# EAGLE board Versie2 (EAGLE 6.5.0), part 1 of 2
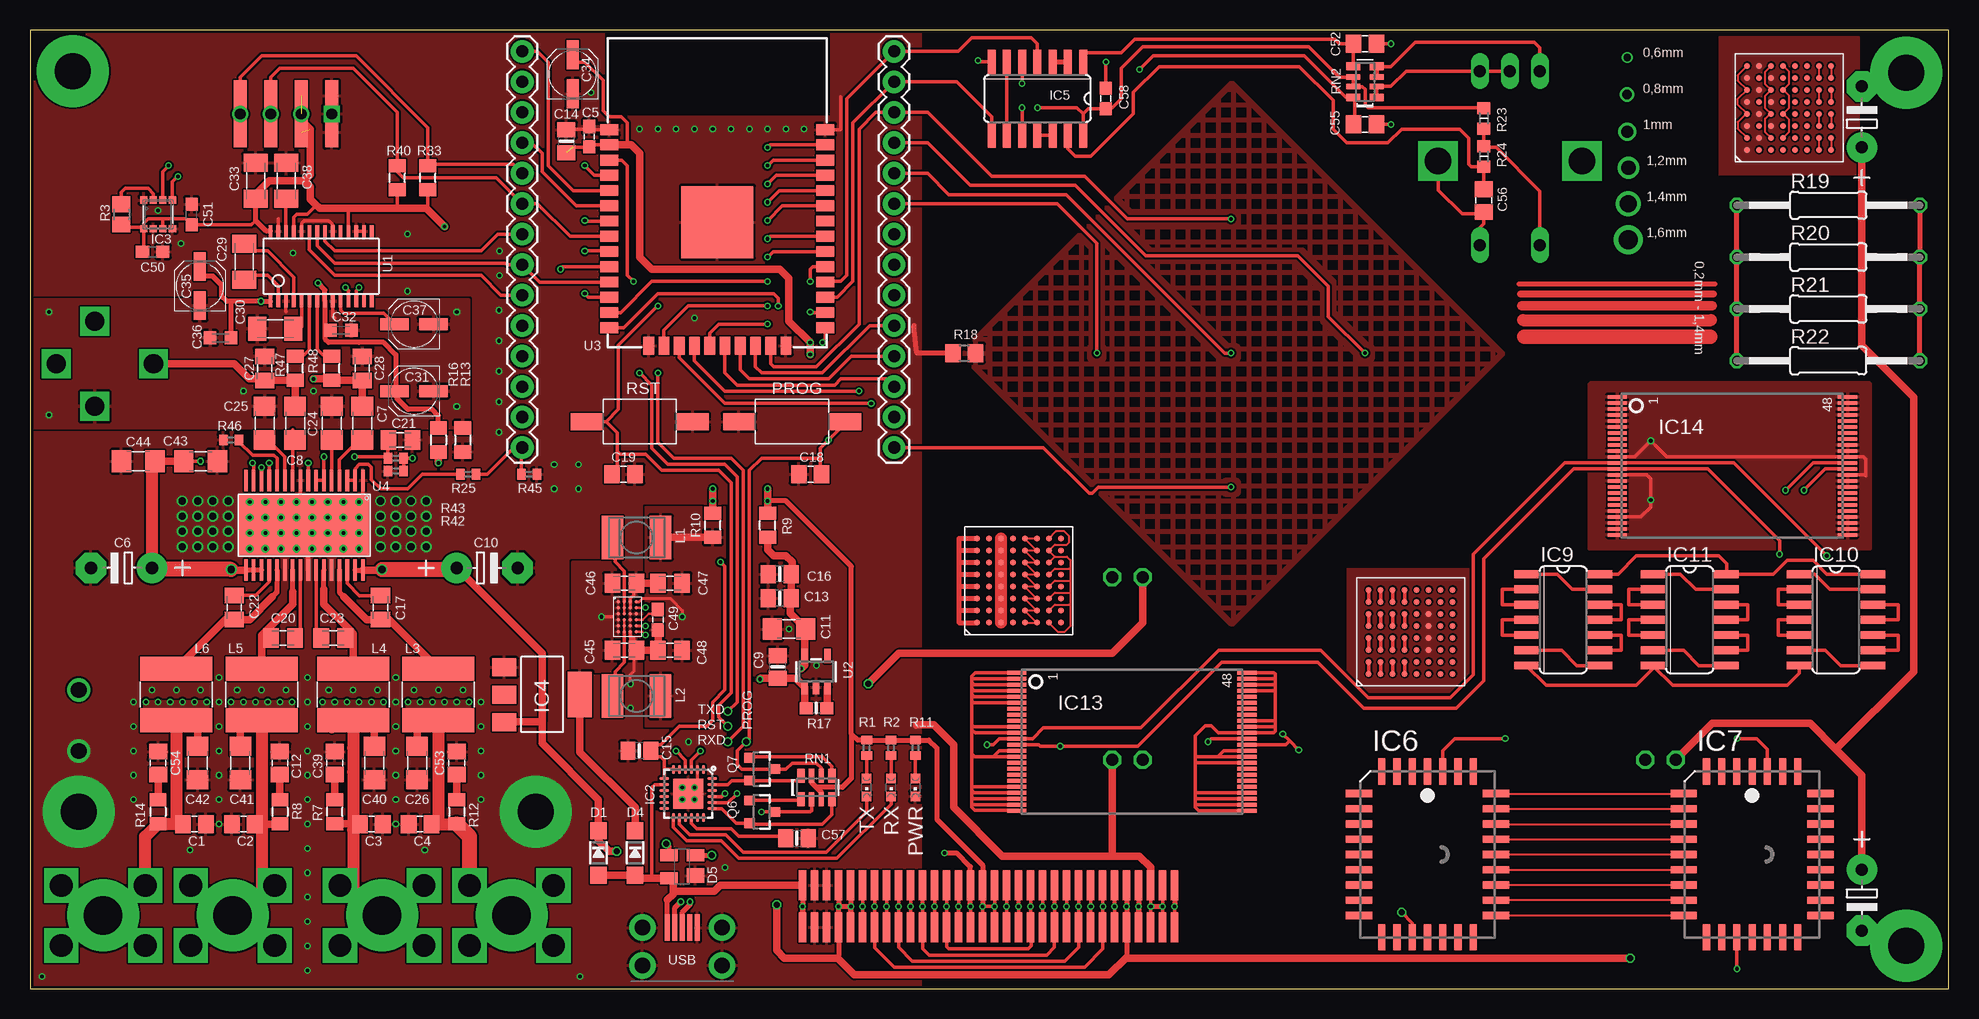
[diagram p7: board, top side]
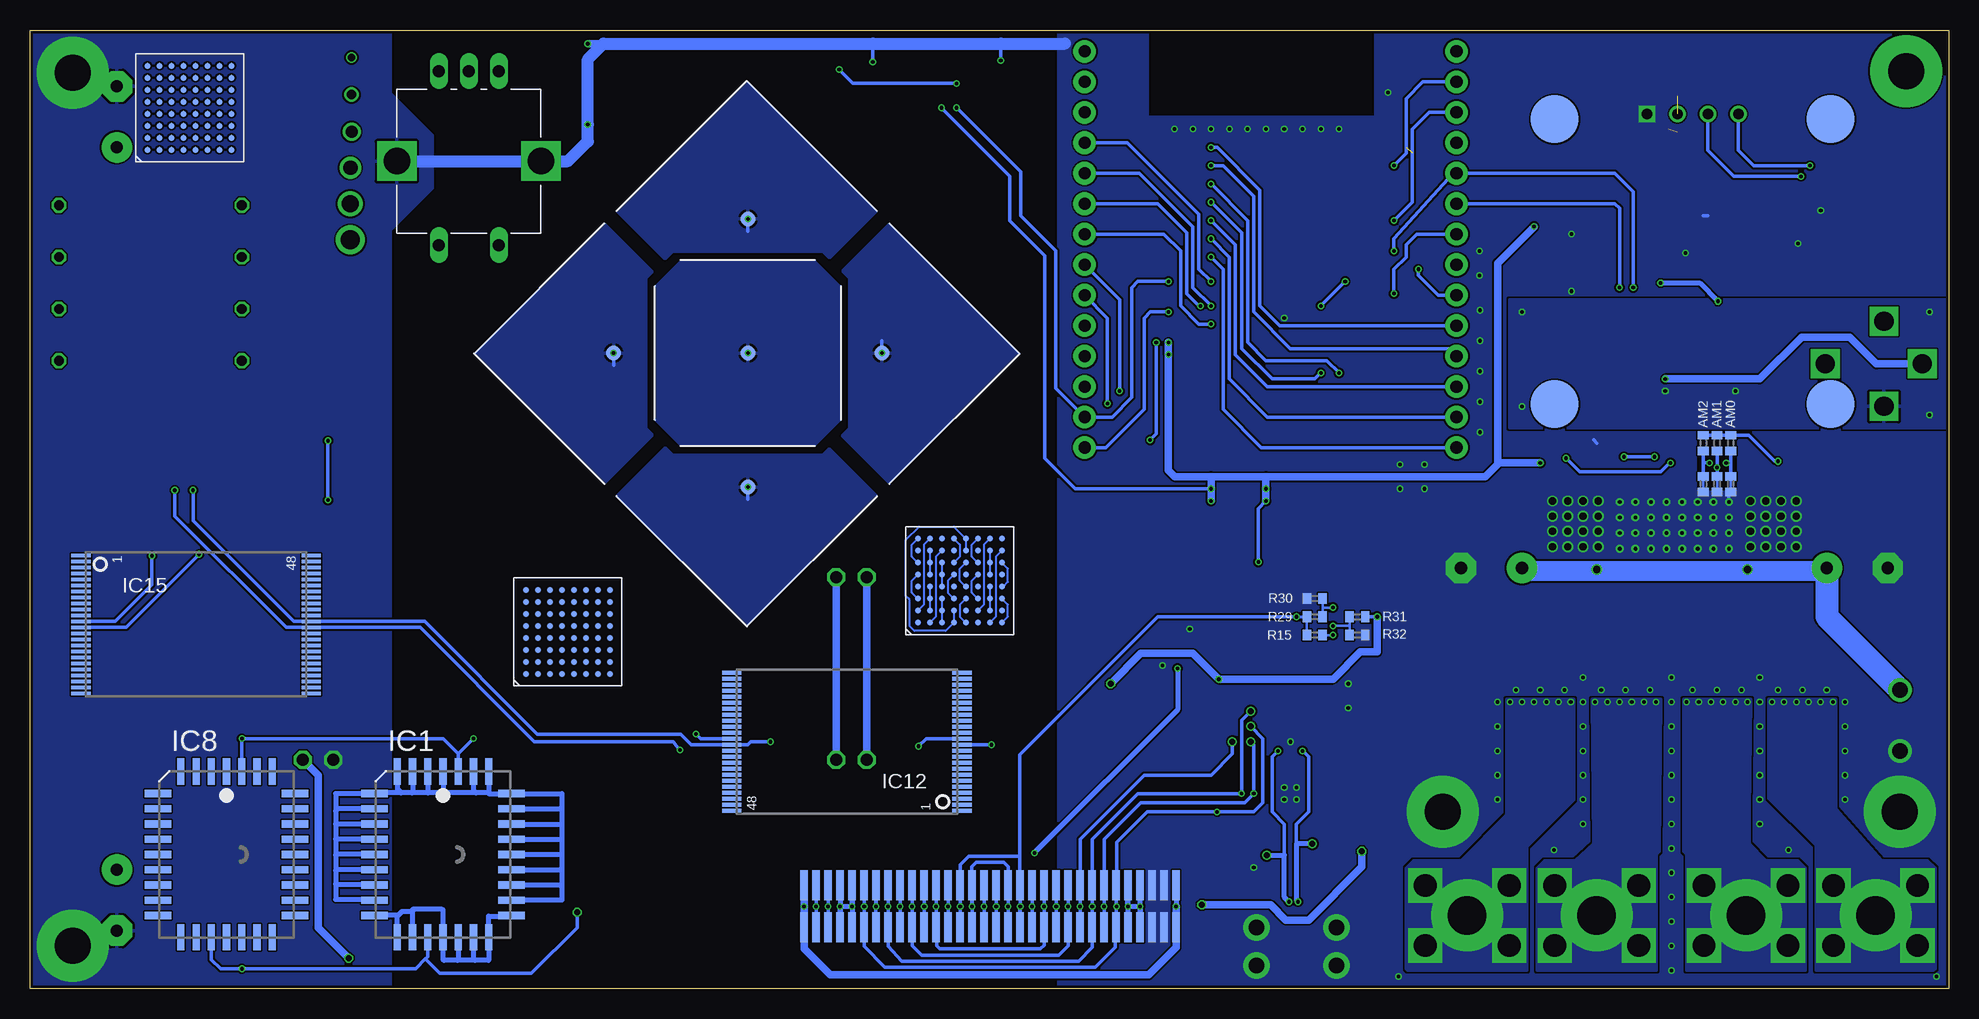
[diagram p8: board, bottom side, seen from below]

Size 159.89 x 79.88 mm. Coordinates in mm from the lower left corner, seen from the top.
Outline: 159.89,0 159.89,79.88 0,79.88 0,0 159.89,0
Copper layers (1*16): Top 0.018mm / dielectric 1.55mm / Bottom 0.018mm
Design rules "eC_2Layer_PClass6_BaseCopperO18_eCDefault *": minimum track width 0.15mm, minimum drill 0.3mm, track to track 0.15mm, track to pad 0.15mm, pad to pad 0.15mm, via to via 0.15mm, smd to smd 0mil, copper to edge 0.25mm, drill to drill 0.35mm, minimum pad ring 0.175mm, minimum via ring 0.125mm, stop-mask expansion 0mil, vias tented up to drill 0.45mm, thermal gap 0.2mm
Net classes: 0 default: width 0.152 mm, drill 0.25 mm, clearance 0.152 mm; 1 gnd: width 0.254 mm, drill 0.3 mm, clearance 0.152 mm; 2 vcc: width 0.254 mm, drill 0.3 mm, clearance 0.152 mm

## Footprints (pad centres in the part's own frame; a part is rotated, then mirrored left to right if it is on the bottom)
R0402 = smd 0.7 x 0.9: 1 -0.65,0; 2 0.65,0
C0805 = smd 1.3 x 1.5: 1 -0.95,0; 2 0.95,0
C0603 = smd 1.1 x 1: 1 -0.85,0; 2 0.85,0
E5-13 = drill 1.016 pad 2.54: + -2.54,0 | drill 1.016 pad 2.54 octagon: - 2.54,0
C1206 = smd 1.6 x 1.8: 1 -1.4,0; 2 1.4,0
0805-NO = smd 1.24 x 1.5: 1 -0.95,0; 2 0.95,0
C0805K = smd 1.3 x 1.6: 1 -1,0; 2 1,0
C1206K = smd 1.5 x 2: 1 -1.5,0; 2 1.5,0
UD-4X5,8_NICHICON = smd 2.4 x 1: + 1.625,0; - -1.625,0
C0603K = smd 1.05 x 1.08: 1 -0.875,0; 2 0.875,0
0603 = smd 1.1 x 1: 1 -0.85,0; 2 0.85,0
SOD-123 = smd 1.4 x 1.4: A 1.85,0; C -1.85,0
SOT143 = smd 1.2 x 1.44: 1 -0.75,-1.1 | smd 1 x 1.44: 2 0.95,-1.1; 3 0.95,1.1; 4 -0.95,1.1
PLCC32R = smd 0.6 x 2.2: 1 0,6.9; 2 -1.27,6.9; 3 -2.54,6.9; 4 -3.81,6.9; 14 -3.81,-6.9; 15 -2.54,-6.9; 16 -1.27,-6.9; 17 0,-6.9; 18 1.27,-6.9; 19 2.54,-6.9; 20 3.81,-6.9; 30 3.81,6.9; 31 2.54,6.9; 32 1.27,6.9 | smd 2.2 x 0.6: 5 -5.7,5.08; 6 -5.7,3.81; 7 -5.7,2.54; 8 -5.7,1.27; 9 -5.7,0; 10 -5.7,-1.27; 11 -5.7,-2.54; 12 -5.7,-3.81; 13 -5.7,-5.08; 21 5.7,-5.08; 22 5.7,-3.81; 23 5.7,-2.54; 24 5.7,-1.27; 25 5.7,0; 26 5.7,1.27; 27 5.7,2.54; 28 5.7,3.81; 29 5.7,5.08
QFN24_4MM_SMSC = smd 0.8 x 0.28: 1 -2,1.25; 2 -2,0.75; 3 -2,0.25; 4 -2,-0.25; 5 -2,-0.75; 6 -2,-1.25; 13 2,-1.25; 14 2,-0.75; 15 2,-0.25; 16 2,0.25; 17 2,0.75; 18 2,1.25 | smd 0.28 x 0.8: 7 -1.25,-2; 8 -0.75,-2; 9 -0.25,-2; 10 0.25,-2; 11 0.75,-2; 12 1.25,-2; 19 1.25,2; 20 0.75,2; 21 0.25,2; 22 -0.25,2; 23 -0.75,2; 24 -1.25,2 | smd 2.5 x 2.5: THERM 0,0
BME280 = smd 0.6 x 0.6: 1 1.2,-1.2; 2 0.4,-1.2; 3 -0.4,-1.2; 4 -1.2,-1.2; 5 -1.2,1.2; 6 -0.4,1.2; 7 0.4,1.2; 8 1.2,1.2
SOT223 = smd 1.499 x 2.007: 1 -2.261,-3.15; 2 0.025,-3.15; 3 2.311,-3.15 | smd 3.81 x 2.007: 4 0,3.15
SO14 = smd 0.66 x 2.032: 1 -3.81,-3.073; 2 -2.54,-3.073; 3 -1.27,-3.073; 4 0,-3.073; 5 1.27,-3.073; 6 2.54,-3.073; 7 3.81,-3.073; 8 3.81,3.073; 9 2.54,3.073; 10 1.27,3.073; 11 0,3.073; 12 -1.27,3.073; 13 -2.54,3.073; 14 -3.81,3.073
TSOP48 = smd 1.6 x 0.3: 1 -9.6,5.75; 2 -9.6,5.25; 3 -9.6,4.75; 4 -9.6,4.25; 5 -9.6,3.75; 6 -9.6,3.25; 7 -9.6,2.75; 8 -9.6,2.25; 9 -9.6,1.75; 10 -9.6,1.25; 11 -9.6,0.75; 12 -9.6,0.25; 13 -9.6,-0.25; 14 -9.6,-0.75; 15 -9.6,-1.25; 16 -9.6,-1.75; 17 -9.6,-2.25; 18 -9.6,-2.75; 19 -9.6,-3.25; 20 -9.6,-3.75; 21 -9.6,-4.25; 22 -9.6,-4.75; 23 -9.6,-5.25; 24 -9.6,-5.75; 25 9.6,-5.75; 26 9.6,-5.25; 27 9.6,-4.75; 28 9.6,-4.25; 29 9.6,-3.75; 30 9.6,-3.25; 31 9.6,-2.75; 32 9.6,-2.25; 33 9.6,-1.75; 34 9.6,-1.25; 35 9.6,-0.75; 36 9.6,-0.25; 37 9.6,0.25; 38 9.6,0.75; 39 9.6,1.25; 40 9.6,1.75; 41 9.6,2.25; 42 9.6,2.75; 43 9.6,3.25; 44 9.6,3.75; 45 9.6,4.25; 46 9.6,4.75; 47 9.6,5.25; 48 9.6,5.75
1X14 = drill 1.016 pad 1.88: 1 0,0; 2 2.54,0; 3 5.08,0; 4 7.62,0; 5 10.16,0; 6 12.7,0; 7 15.24,0; 8 17.78,0; 9 20.32,0; 10 22.86,0; 11 25.4,0; 12 27.94,0; 13 30.48,0; 14 33.02,0
L4532P = smd 1.8 x 3.6: 1 -2,0; 2 2,0
SRN6045 = smd 2 x 6: 1 -2.15,0; 2 2.15,0
CHIPLED_0603 = smd 0.8 x 0.8: A 0,-0.75; C 0,0.75
SOT23-3 = smd 0.8 x 0.9: 1 -0.95,-1; 2 0.95,-1; 3 0,1.1
R0805 = smd 1.3 x 1.5: 1 -0.85,0; 2 0.85,0
R0805' = smd 1.1 x 1.4: 1 -1,0; 2 1,0
0603-NO = smd 1.075 x 1: 1 -0.85,0; 2 0.85,0
R0805'' = smd 1.3 x 1.5: 1 -0.95,0; 2 0.95,0
0207/15 = drill 0.813 octagon: 1 -7.62,0; 2 7.62,0
R0603 = smd 1 x 1.1: 1 -0.85,0; 2 0.85,0
RN8P-4R-CRA06S = smd 0.63 x 1.15: 1 -1.295,-0.975; 4 1.295,-0.975; 5 1.295,0.975; 8 -1.295,0.975 | smd 0.44 x 1.15: 2 -0.4,-0.975; 3 0.4,-0.975; 6 0.4,0.975; 7 -0.4,0.975
SW2-4.0-6.0X3.0X2.5MM = smd 2.65 x 1.4: 1 -4.425,0; 2 4.425,0
B1,27 = smd 1.27 x 1.27: TP 0,0
TSSOP-28 = smd 0.305 x 0.991: 1 -4.225,-2.918; 2 -3.575,-2.918; 3 -2.925,-2.918; 4 -2.275,-2.918; 5 -1.625,-2.918; 6 -0.975,-2.918; 7 -0.325,-2.918; 8 0.325,-2.918; 9 0.975,-2.918; 10 1.625,-2.918; 11 2.275,-2.918; 12 2.925,-2.918; 13 3.575,-2.918; 14 4.225,-2.918; 15 4.225,2.918; 16 3.575,2.918; 17 2.925,2.918; 18 2.275,2.918; 19 1.625,2.918; 20 0.975,2.918; 21 0.325,2.918; 22 -0.325,2.918; 23 -0.975,2.918; 24 -1.625,2.918; 25 -2.275,2.918; 26 -2.925,2.918; 27 -3.575,2.918; 28 -4.225,2.918
SOT23-5 = smd 0.55 x 1.2: 1 -0.95,-1.3; 2 0,-1.3; 3 0.95,-1.3; 4 0.95,1.3; 5 -0.95,1.3
ESP-WROOM-32 = smd 0.9 x 1.5: 1 7.7,9; 2 6.43,9; 3 5.16,9; 4 3.89,9; 5 2.62,9; 6 1.35,9; 7 0.08,9; 8 -1.19,9; 9 -2.46,9; 10 -3.73,9; 11 -5,9; 12 -6.27,9; 13 -7.54,9; 14 -8.81,9; 25 -8.81,-9; 26 -7.54,-9; 27 -6.27,-9; 28 -5,-9; 29 -3.73,-9; 30 -2.46,-9; 31 -1.19,-9; 32 0.08,-9; 33 1.35,-9; 34 2.62,-9; 35 3.89,-9; 36 5.16,-9; 37 6.43,-9; 38 7.7,-9 | smd 1.5 x 0.9: 15 -10.3,5.715; 16 -10.3,4.445; 17 -10.3,3.175; 18 -10.3,1.905; 19 -10.3,0.635; 20 -10.3,-0.635; 21 -10.3,-1.905; 22 -10.3,-3.175; 23 -10.3,-4.445; 24 -10.3,-5.715 | smd 6 x 6: GND 0,0
TSSOP32-GROUNDPAD = smd 1.8 x 0.3: AM0 -3.737,-4.225; AM1 -3.737,-3.575; AM2 -3.737,-2.925; AVCC 3.737,-4.875; BSNL 3.737,-2.925; BSNR 3.737,0.975; BSPL 3.737,-0.325; BSPR 3.737,3.575; FAULTZ -3.737,3.575; GAIN/SLV -3.737,0.325; GND1 -3.737,-0.325; GND2 3.737,-1.625; GND3 3.737,0.325; GND4 3.737,2.275; GVDD -3.737,0.975; INNL -3.737,-1.625; INNR -3.737,2.275; INPL -3.737,-0.975; INPR -3.737,2.925; MODSEL -3.737,4.875; MUTE -3.737,-2.275; OUTNL 3.737,-2.275; OUTNR 3.737,1.625; OUTPL 3.737,-0.975; OUTPR 3.737,2.925; PLIMIT -3.737,1.625; PVCC1 3.737,-4.225; PVCC2 3.737,-3.575; PVCC3 3.737,4.225; PVCC4 3.737,4.875; SDZ -3.737,4.225; SYNC -3.737,-4.875 | drill 0.3: P$33 0.65,4.55; P$34 -0.65,4.55; P$35 -1.95,4.55; P$36 1.95,4.55; P$37 -1.95,3.25; P$38 -1.95,1.95; P$39 -1.95,0.65; P$40 -1.95,-0.65; P$41 -1.95,-1.95; P$42 -1.95,-3.25; P$43 -1.95,-4.55; P$44 -0.65,3.25; P$45 0.65,3.25; P$46 1.95,3.25; P$47 -0.65,1.95; P$48 0.65,1.95; P$49 1.95,1.95; P$50 1.95,0.65; P$51 0.65,0.65; P$52 -0.65,0.65; P$53 -0.65,-0.65; P$54 0.65,-0.65; P$55 1.95,-0.65; P$56 1.95,-1.95; P$57 1.95,-3.25; P$58 1.95,-4.55; P$59 0.65,-4.55; P$60 0.65,-3.25; P$61 0.65,-1.95; P$62 -0.65,-1.95; P$63 -0.65,-3.25; P$64 -0.65,-4.55 | smd 5 x 11: POWERPAD 0,0.005
0714360864 = smd 0.635 x 2.5: P$1 -15.5,-1.75; P$2 -14.5,-1.75; P$3 -13.5,-1.75; P$4 -12.5,-1.75; P$5 -11.5,-1.75; P$6 -10.5,-1.75; P$7 -9.5,-1.75; P$8 -8.5,-1.75; P$9 -7.5,-1.75; P$10 -6.5,-1.75; P$11 -5.5,-1.75; P$12 -4.5,-1.75; P$13 -3.5,-1.75; P$14 -2.5,-1.75; P$15 -1.5,-1.75; P$16 -0.5,-1.75; P$17 0.5,-1.75; P$18 1.5,-1.75; P$19 2.5,-1.75; P$20 3.5,-1.75; P$21 4.5,-1.75; P$22 5.5,-1.75; P$23 6.5,-1.75; P$24 7.5,-1.75; P$25 8.5,-1.75; P$26 9.5,-1.75; P$27 10.5,-1.75; P$28 11.5,-1.75; P$29 12.5,-1.75; P$30 13.5,-1.75; P$31 14.5,-1.75; P$32 15.5,-1.75; P$33 15.5,1.75; P$34 14.5,1.75; P$35 13.5,1.75; P$36 12.5,1.75; P$37 11.5,1.75; P$38 10.5,1.75; P$39 9.5,1.75; P$40 8.5,1.75; P$41 7.5,1.75; P$42 6.5,1.75; P$43 5.5,1.75; P$44 4.5,1.75; P$45 3.5,1.75; P$46 2.5,1.75; P$47 1.5,1.75; P$48 0.5,1.75; P$49 -0.5,1.75; P$50 -1.5,1.75; P$51 -2.5,1.75; P$52 -3.5,1.75; P$53 -4.5,1.75; P$54 -5.5,1.75; P$55 -6.5,1.75; P$56 -7.5,1.75; P$57 -8.5,1.75; P$58 -9.5,1.75; P$59 -10.5,1.75; P$60 -11.5,1.75; P$61 -12.5,1.75; P$62 -13.5,1.75; P$63 -14.5,1.75; P$64 -15.5,1.75
DISPLAY = drill 0.9 square: P$1 -3.81,12.18 | drill 0.9: P$2 -1.27,12.18; P$3 1.27,12.18; P$4 3.81,12.18 | smd 4 x 4: P$5 -11.5,11.75; P$6 11.5,11.75; P$7 -11.5,-12; P$8 11.5,-12 | smd 1.1 x 2.54 bottom: P$9 -3.81,10.668; P$10 -1.27,13.716; P$11 1.27,10.668; P$12 3.81,13.716; P$13 -3.81,13.716; P$14 -1.27,10.668; P$15 1.27,13.716; P$16 3.81,10.668
BGA64 = smd 0.5 x 0.5: P$1 -3.5,3.5; P$2 -3.5,2.5; P$3 -3.5,1.5; P$4 -3.5,0.5; P$5 -3.5,-0.5; P$6 -3.5,-1.5; P$7 -3.5,-2.5; P$8 -3.5,-3.5; P$9 -2.5,3.5; P$10 -2.5,2.5; P$11 -2.5,1.5; P$12 -2.5,0.5; P$13 -2.5,-0.5; P$14 -2.5,-1.5; P$15 -2.5,-2.5; P$16 -2.5,-3.5; P$17 -1.5,3.5; P$18 -1.5,2.5; P$19 -1.5,1.5; P$20 -1.5,0.5; P$21 -1.5,-0.5; P$22 -1.5,-1.5; P$23 -1.5,-2.5; P$24 -1.5,-3.5; P$25 -0.5,3.5; P$26 -0.5,2.5; P$27 -0.5,1.5; P$28 -0.5,0.5; P$29 -0.5,-0.5; P$30 -0.5,-1.5; P$31 -0.5,-2.5; P$32 -0.5,-3.5; P$33 0.5,3.5; P$34 0.5,2.5; P$35 0.5,1.5; P$36 0.5,0.5; P$37 0.5,-0.5; P$38 0.5,-1.5; P$39 0.5,-2.5; P$40 0.5,-3.5; P$41 1.5,3.5; P$42 1.5,2.5; P$43 1.5,1.5; P$44 1.5,0.5; P$45 1.5,-0.5; P$46 1.5,-1.5; P$47 1.5,-2.5; P$48 1.5,-3.5; P$49 2.5,3.5; P$50 2.5,2.5; P$51 2.5,1.5; P$52 2.5,0.5; P$53 2.5,-0.5; P$54 2.5,-1.5; P$55 2.5,-2.5; P$56 2.5,-3.5; P$57 3.5,3.5; P$58 3.5,2.5; P$59 3.5,1.5; P$60 3.5,0.5; P$61 3.5,-0.5; P$62 3.5,-1.5; P$63 3.5,-2.5; P$64 3.5,-3.5
SCREWCON = drill 1.9 square: P$1 -2.5,3.5; P$2 2.5,3.5; P$3 -2.5,-3.5; P$4 2.5,-3.5
DSBGA24 = smd 0.3 x 0.3: A1 1.249,0.751; A2 1.249,0.251; A3 1.249,-0.249; A4 1.249,-0.749; B1 0.749,0.751; B2 0.749,0.251; B3 0.749,-0.249; B4 0.749,-0.749; C1 0.249,0.751; C2 0.249,0.251; C3 0.249,-0.249; C4 0.249,-0.749; D1 -0.251,0.751; D2 -0.251,0.251; D3 -0.251,-0.249; D4 -0.251,-0.749; E1 -0.751,0.751; E2 -0.751,0.251; E3 -0.751,-0.249; E4 -0.751,-0.749; F1 -1.251,0.751; F2 -1.251,0.251; F3 -1.251,-0.249; F4 -1.251,-0.749
JACKSTRAIGHTUP = drill 1.6 square: P$1 -3.55,0; P$2 0,3.2; P$3 3.55,0; P$4 0,-4.9
ENCODER = drill 1 long: A 2.5,-7.5; B1 0,-7.5; B2 -2.5,-7.5; COM -2.5,7; SW 2.5,7 | drill 2.2 square: P$6 -6,0; P$7 6,0
MICRO-B-SMT = smd 0.4 x 2.2: 1 1.24,0; 2 0.62,0; 3 0,0; 4 -0.62,0; 5 -1.24,0 | drill 1.3 pad 2.2: P$6 -3.325,3.15; P$7 -3.325,0; P$8 3.325,3.15; P$9 3.325,0

## Placement (x,y rotation side)
AM0  0  [R0402]  18.16,42.04 90 bottom
AM1  0  [R0402]  19.3,42.04 90 bottom
AM2  0  [R0402]  20.45,42.04 90 bottom
C1  1n  [C0805]  13.72,13.72 180 top
C2  1n  [C0805]  17.78,13.72 180 top
C3  1n  [C0805]  28.45,13.72 180 top
C4  1n  [C0805]  32.51,13.72 180 top
C5  100n  [C0603]  46.61,70.99 90 top
C6  [E5-13]  7.62,35.05 180 top
C7  1u  [C1206]  27.69,47.12 270 top
C8  1u  [C1206]  22.1,47.12 270 top
C9  10uF  [0805-NO]  62.32,26.8 90 top
C10  [E5-13]  38.1,35.05 0 top
C11  1uF  [C1206]  63.25,29.96 180 top
C12  10n  [C0805]  20.83,18.8 90 top
C13  10uF  [0805-NO]  62.47,32.52 180 top
C14  10uF  [0805-NO]  44.7,70.61 90 top
C15  10uF  [0805-NO]  50.79,19.81 180 top
C16  10uF  [0805-NO]  62.48,34.54 180 top
C17  220n  [C0805K]  29.21,31.75 270 top
C18  1n  [C0805]  65.02,42.86 180 top
C19  1n  [C0805]  49.47,42.86 0 top
C20  220n  [C0805K]  21.08,29.21 180 top
C21  1u  [C0805K]  30.86,45.72 0 top
C22  220n  [C0805K]  17.02,31.75 270 top
C23  220n  [C0805K]  25.27,29.21 0 top
C24  1u  [C1206]  25.15,47.12 270 top
C25  1u  [C1206]  19.56,47.12 270 top
C26  1u  [C1206]  32.26,18.8 90 top
C27  2n2  [C0805K]  19.56,51.69 90 top
C28  2n2  [C0805K]  27.69,51.69 90 top
C29  2u2  [C1206K]  17.84,60.58 90 top
C30  2u2  [C1206K]  20.45,54.99 180 top
C31  10u  [UD-4X5,8_NICHICON]  32,49.78 180 top
C32  100n  [C0603K]  25.91,54.86 180 top
C33  2u2  [C1206K]  18.8,67.31 270 top
C34  10u  [UD-4X5,8_NICHICON]  45.21,76.2 90 top
C35  10u  [UD-4X5,8_NICHICON]  14.16,58.55 90 top
C36  100n  [C0603K]  15.88,54.23 0 top
C37  10u  [UD-4X5,8_NICHICON]  32,55.37 180 top
C38  2u2  [C1206K]  21.34,67.31 90 top
C39  10n  [C0805]  25.4,18.8 90 top
C40  1u  [C1206]  28.7,18.8 270 top
C41  1u  [C1206]  17.53,18.8 90 top
C42  1u  [C1206]  13.97,18.8 270 top
C43  1u  [C1206]  14.22,43.94 0 top
C44  1u  [C1206]  9.02,43.94 180 top
C45  22u  [C0805K]  49.53,28.19 0 top
C46  22u  [C0805K]  49.53,33.78 0 top
C47  47u  [C0805K]  53.34,33.78 180 top
C48  47u  [C0805K]  53.34,28.19 180 top
C49  3n3  [C0603]  52.32,30.73 270 top
C50  0.1uF  [0603]  10.22,61.4 0 top
C51  0.1uF  [0603]  13.46,64.52 90 top
C52  10n  [C0805]  111.25,78.74 0 top
C53  10n  [C0805]  35.56,18.8 90 top
C54  10n  [C0805]  10.67,18.8 90 top
C55  10n  [C0805]  111.25,72.01 0 top
C56  10n  [C0805]  121.16,65.66 270 top
C57  4u7  [0805-NO]  63.92,12.54 0 top
C58  100n  [C0603]  89.66,74.17 90 top
C59  [E5-13]  152.65,7.37 270 top
C60  [E5-13]  152.65,72.64 90 top
D1  MBR120  [SOD-123]  47.37,11.3 270 top
D4  MBR120  [SOD-123]  50.42,11.3 270 top
D5  SP0503  [SOT143]  54.36,10.16 90 top
IC1  AM29F040J  [PLCC32R]  125.48,11.18 0 bottom
IC2  CP2104  [QFN24_4MM_SMSC]  54.86,16.26 270 top
IC3  BME280  [BME280]  10.67,64.52 180 top
IC4  REG1117  [SOT223]  42.67,24.51 270 top
IC5  4584D  [SO14]  83.95,74.17 180 top
IC6  AM29F040J  [PLCC32R]  116.46,11.18 0 top
IC7  AM29F040J  [PLCC32R]  143.51,11.18 0 top
IC8  AM29F040J  [PLCC32R]  143.51,11.18 0 bottom
IC9  4584D  [SO14]  127.76,30.73 270 top
IC10  4584D  [SO14]  150.5,30.73 270 top
IC11  4584D  [SO14]  138.3,30.73 270 top
IC12  K9F5608  [TSOP48]  91.82,20.57 180 bottom
IC13  K9F5608  [TSOP48]  91.82,20.57 0 top
IC14  K9F5608  [TSOP48]  141.86,43.56 0 top
IC15  K9F5608  [TSOP48]  146.05,30.35 0 bottom
JP1  [1X14]  41.02,45.09 90 top
JP2  [1X14]  72.01,45.09 90 top
L1  1uH  [L4532P]  50.55,37.59 0 top
L2  1uH  [L4532P]  50.55,24.38 0 top
L3  [SRN6045]  34.04,24.51 270 top
L4  [SRN6045]  26.92,24.51 270 top
L5  [SRN6045]  19.3,24.51 270 top
L6  [SRN6045]  12.19,24.51 270 top
PWR  [CHIPLED_0603]  73.79,16.76 180 top
Q6  mmbt2222  [SOT23-3]  60.96,14.73 270 top
Q7  mmbt2222  [SOT23-3]  60.96,18.29 270 top
R1  [R0402]  69.72,20.07 90 top
R2  [R0402]  71.75,20.07 90 top
R3  4.7k  [R0805]  7.62,64.52 270 top
R4  0  [R0402]  18.16,45.47 270 bottom
R5  0  [R0402]  20.45,45.47 270 bottom
R6  0  [R0402]  19.3,45.47 270 bottom
R7  3R3  [R0805']  25.4,14.73 90 top
R8  3R3  [R0805']  20.83,14.73 270 top
R9  0  [R0805']  61.47,38.61 90 top
R10  0  [R0805']  56.9,38.61 90 top
R11  [R0402]  73.79,20.07 90 top
R12  3R3  [R0805']  35.56,14.73 270 top
R13  0  [R0805']  36.07,45.72 270 top
R14  3R3  [R0805']  10.67,14.73 270 top
R15  470k  [R0402]  52.83,29.46 0 bottom
R16  0  [R0805']  34.04,45.72 270 top
R17  100K  [0603-NO]  65.53,23.38 180 top
R18  [R0805'']  77.85,52.96 0 top
R19  [0207/15]  149.86,65.28 0 top
R20  [0207/15]  149.86,60.96 0 top
R21  [0207/15]  149.86,56.64 0 top
R22  [0207/15]  149.86,52.32 0 top
R23  [R0603]  121.16,72.52 90 top
R24  [R0603]  121.16,69.34 90 top
R25  1k  [R0402]  36.51,42.86 180 top
R29  470k  [R0402]  52.83,30.99 0 bottom
R30  150k  [R0402]  52.83,32.51 180 bottom
R31  [R0402]  49.28,30.98 180 bottom
R32  [R0402]  49.28,29.46 0 bottom
R33  4k7  [R0805']  33.15,67.56 90 top
R40  4k7  [R0805']  30.61,67.56 90 top
R42  5k6  [R0402]  30.48,43.13 0 top
R43  open  [R0402]  30.48,44.2 0 top
R45  100k  [R0402]  41.6,42.86 180 top
R46  100k  [R0402]  16.76,45.72 0 top
R47  470  [R0805']  22.1,51.69 90 top
R48  470  [R0805']  25.15,51.69 90 top
RN1  10k  [RN8P-4R-CRA06S]  65.53,16.76 0 top
RN2  10k  [RN8P-4R-CRA06S]  111.25,75.56 90 top
RX  [CHIPLED_0603]  71.75,16.76 180 top
SW1  PROG  [SW2-4.0-6.0X3.0X2.5MM]  63.5,47.24 0 top
SW2  RST  [SW2-4.0-6.0X3.0X2.5MM]  50.8,47.24 180 top
TP1  PTR1B1,27  [B1,27]  100.08,41.78 0 bottom
TP2  PTR1B1,27  [B1,27]  88.9,52.96 0 bottom
TP3  PTR1B1,27  [B1,27]  111.25,52.96 0 bottom
TP4  PTR1B1,27  [B1,27]  100.08,52.96 0 bottom
TP5  PTR1B1,27  [B1,27]  100.08,64.14 0 bottom
TX  [CHIPLED_0603]  69.72,16.76 180 top
U1  PCM5122  [TSSOP-28]  24.26,60.2 0 top
U2  AP2112-3.3  [SOT23-5]  65.51,26.42 0 top
U3  ESP-WROOM-32  [ESP-WROOM-32]  57.28,63.88 90 top
U4  TPA3130  [TSSOP32-GROUNDPAD]  22.86,38.61 270 top
U$1  0714360864  [0714360864]  79.88,6.86 0 top
U$2  DISPLAY  [DISPLAY]  21.34,60.71 0 bottom
U$5  BGA64  [BGA64]  146.6,73.4 0 top
U$9  SCREWCON  [SCREWCON]  40.13,6.1 270 top
U$13  0714360864  [0714360864]  79.88,6.86 180 bottom
U$14  TPS62182  [DSBGA24]  49.78,30.99 90 top
U$16  SCREWCON  [SCREWCON]  29.34,6.1 90 top
U$21  BGA64  [BGA64]  146.6,73.4 0 bottom
U$22  SCREWCON  [SCREWCON]  16.89,6.1 90 top
U$23  SCREWCON  [SCREWCON]  6.1,6.1 90 top
U$24  BGA64  [BGA64]  82.4,34 0 top
U$26  JACKSTRAIGHTUP  [JACKSTRAIGHTUP]  5.4,52.07 90 top
U$32  BGA64  [BGA64]  82.4,34 0 bottom
U$41  ROTARY  [ENCODER]  123.32,68.96 180 bottom
U$42  BGA64  [BGA64]  115.06,29.72 0 top
U$43  BGA64  [BGA64]  115.06,29.72 0 bottom
USB  JRUSB  [MICRO-B-SMT]  54.36,5.08 180 top